# EAGLE schematic motoretc... (EAGLE 8.0.1)
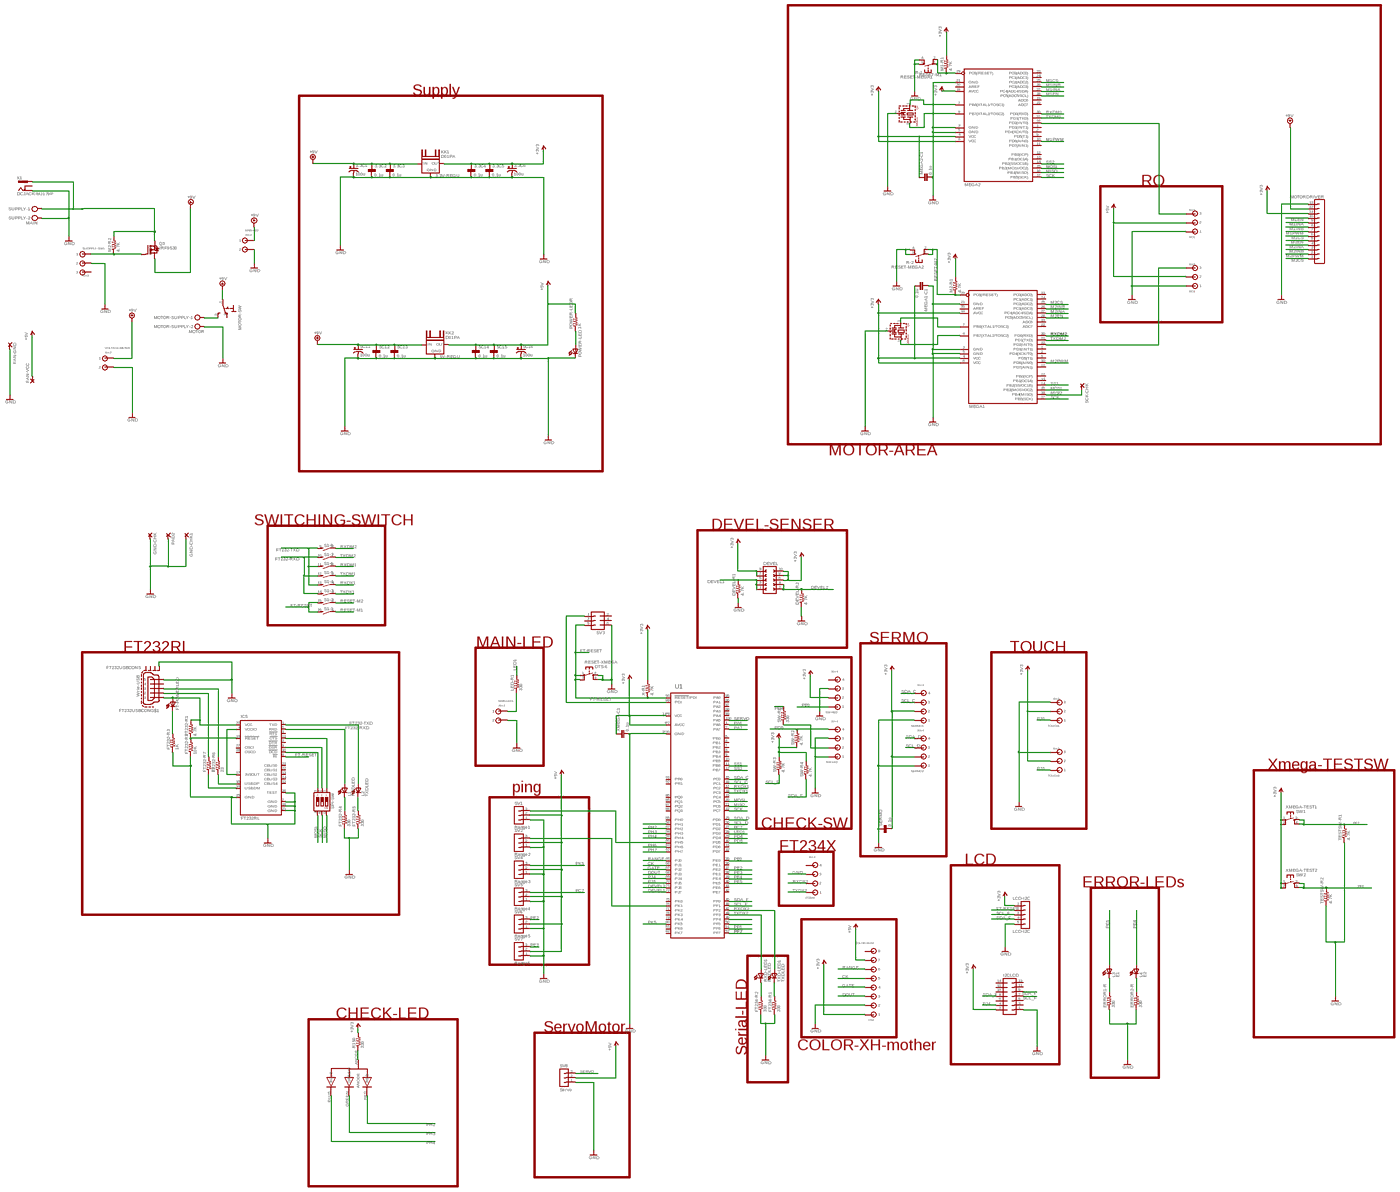
[diagram p0: schematic, sheet 1, overview]
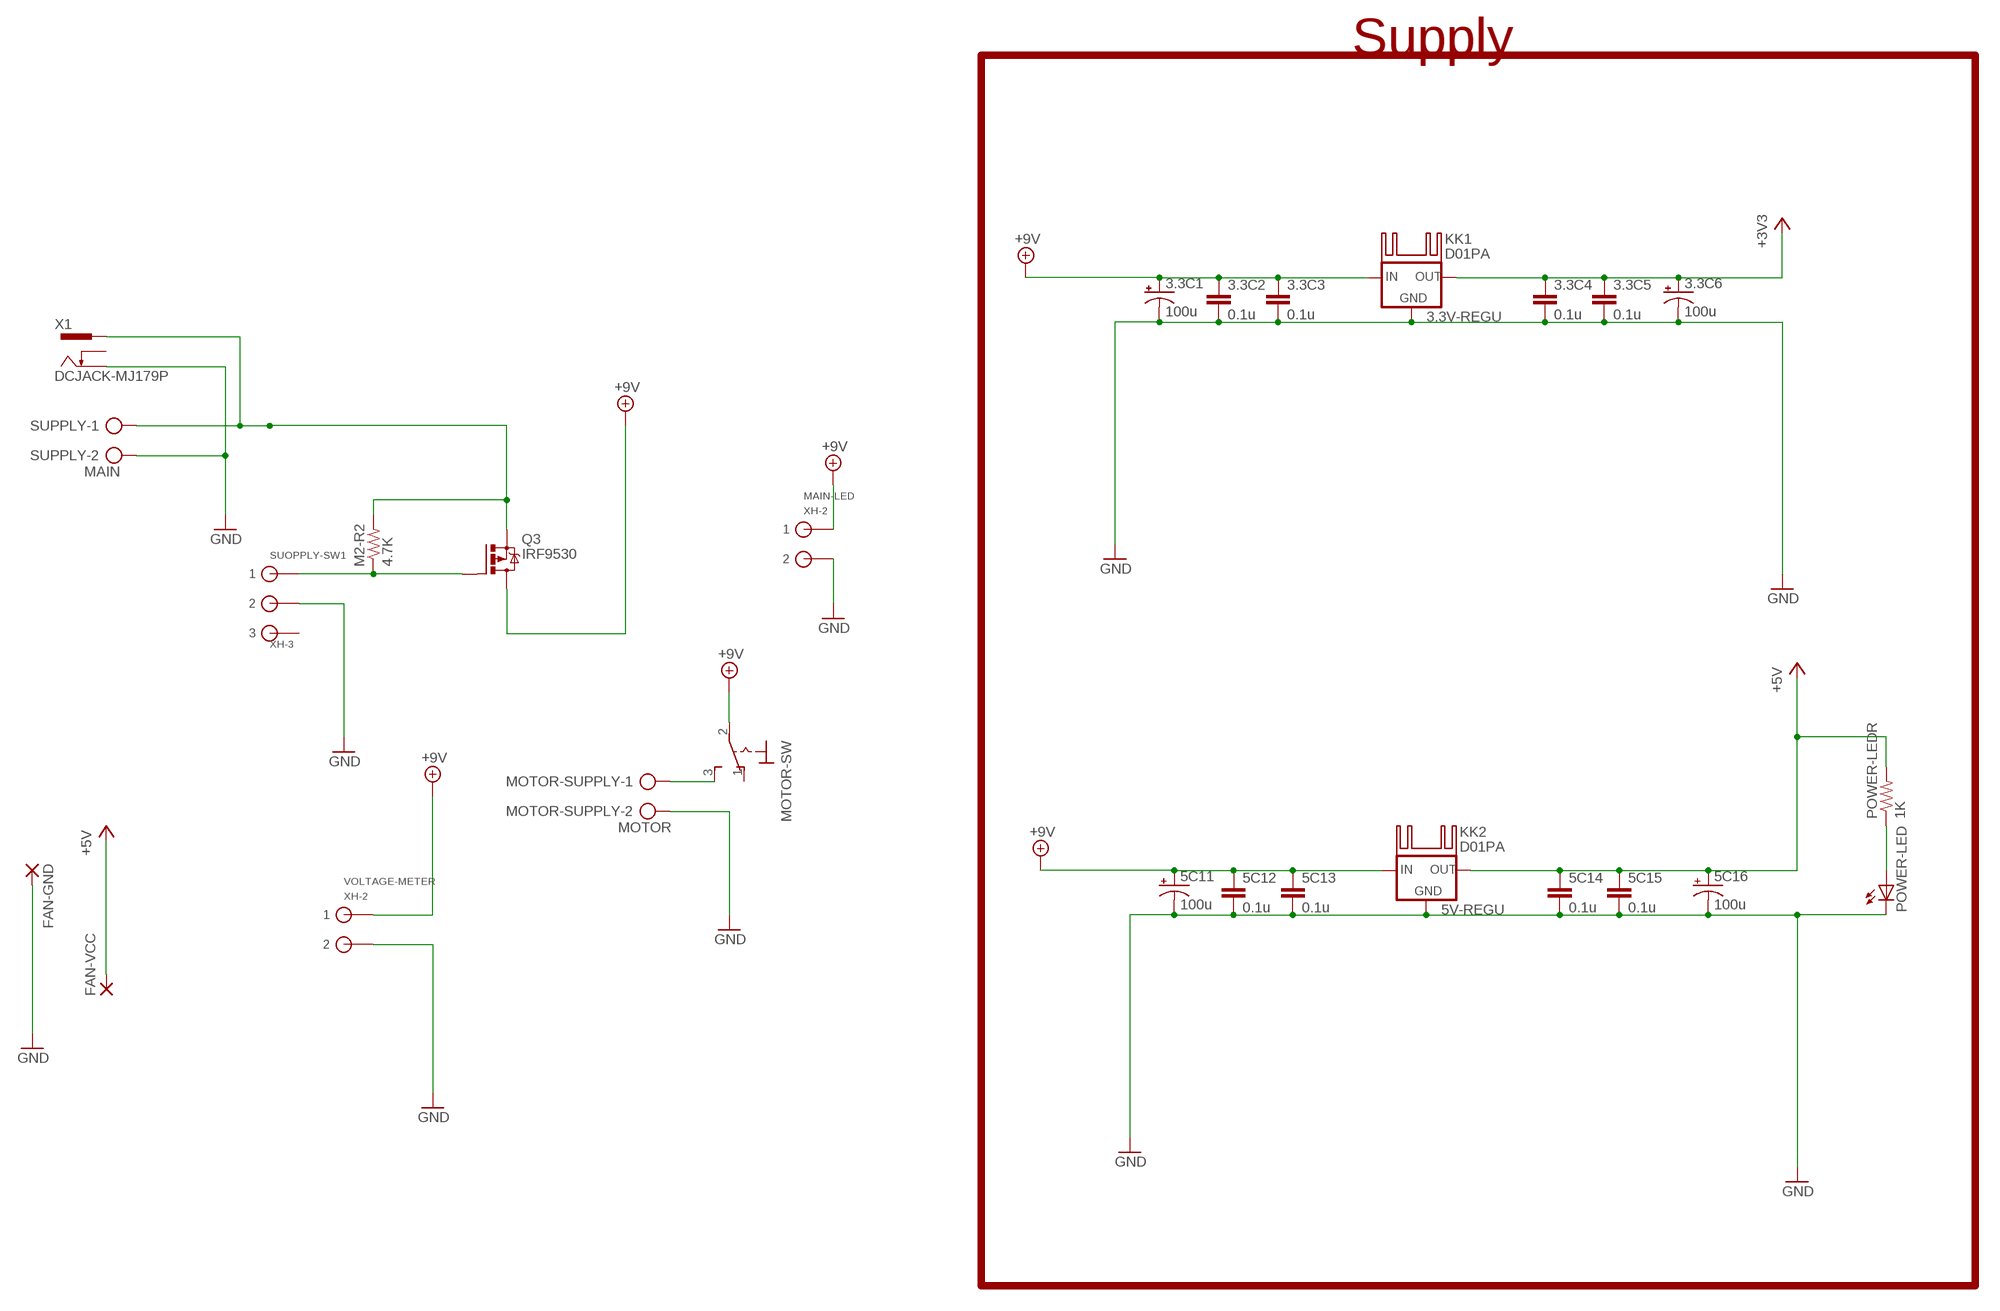
[diagram p1: schematic, sheet 1, part 1 of 4]
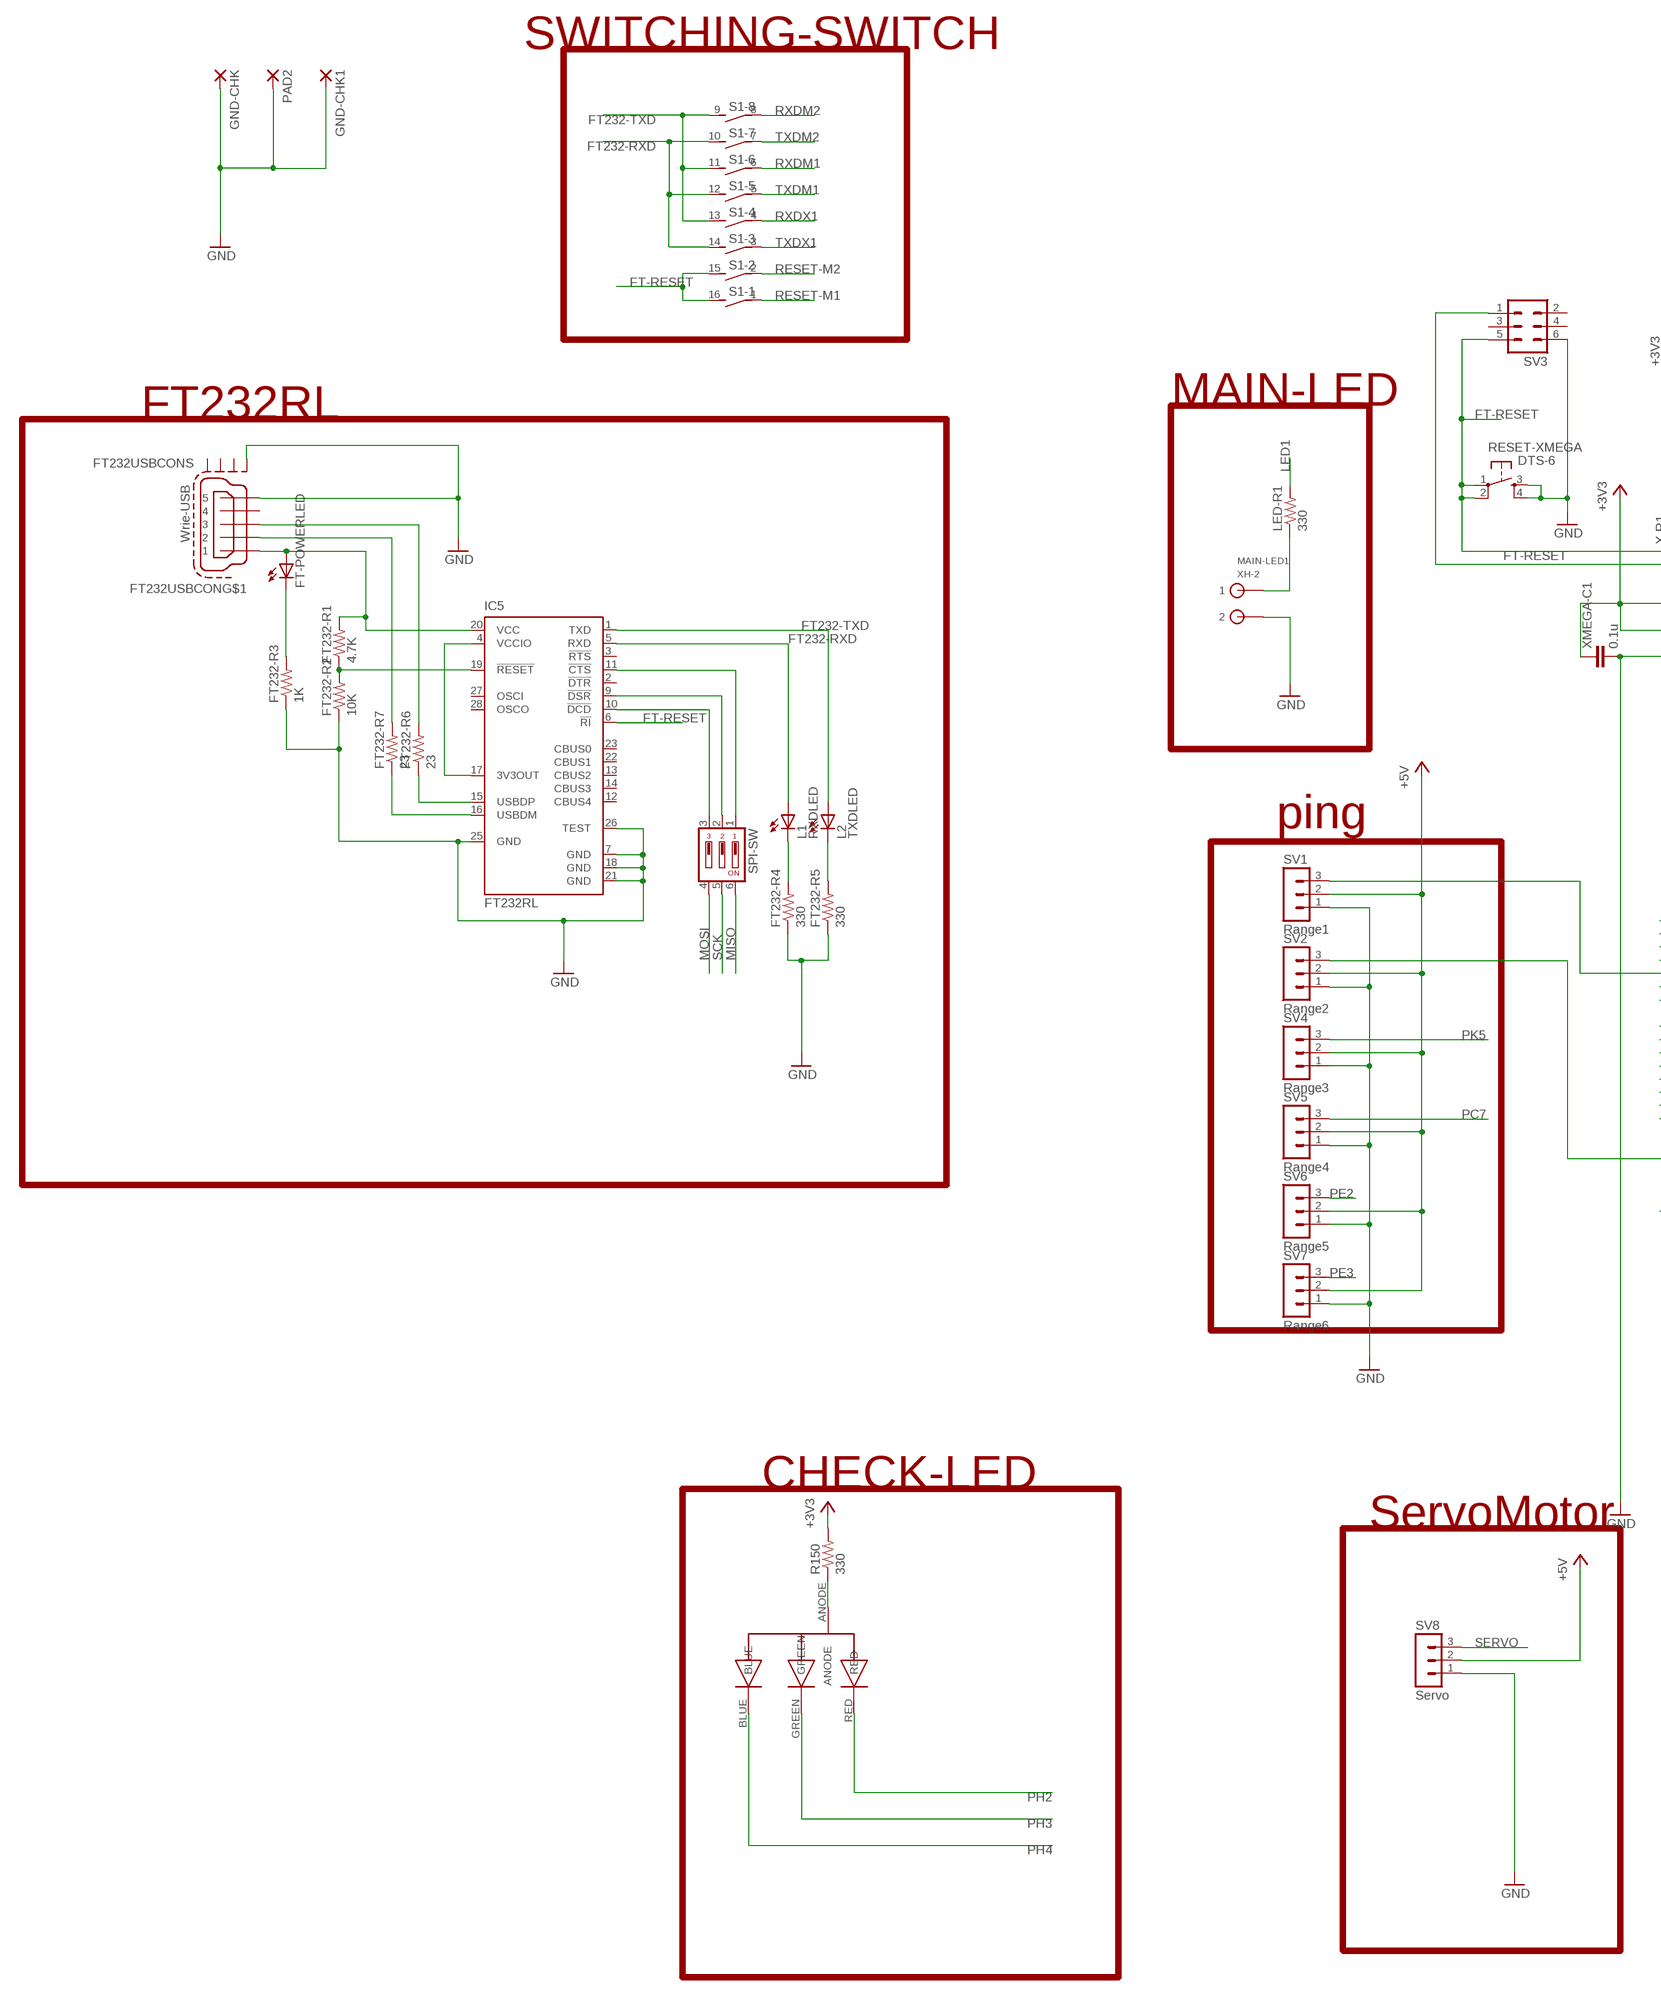
[diagram p2: schematic, sheet 1, part 2 of 4]
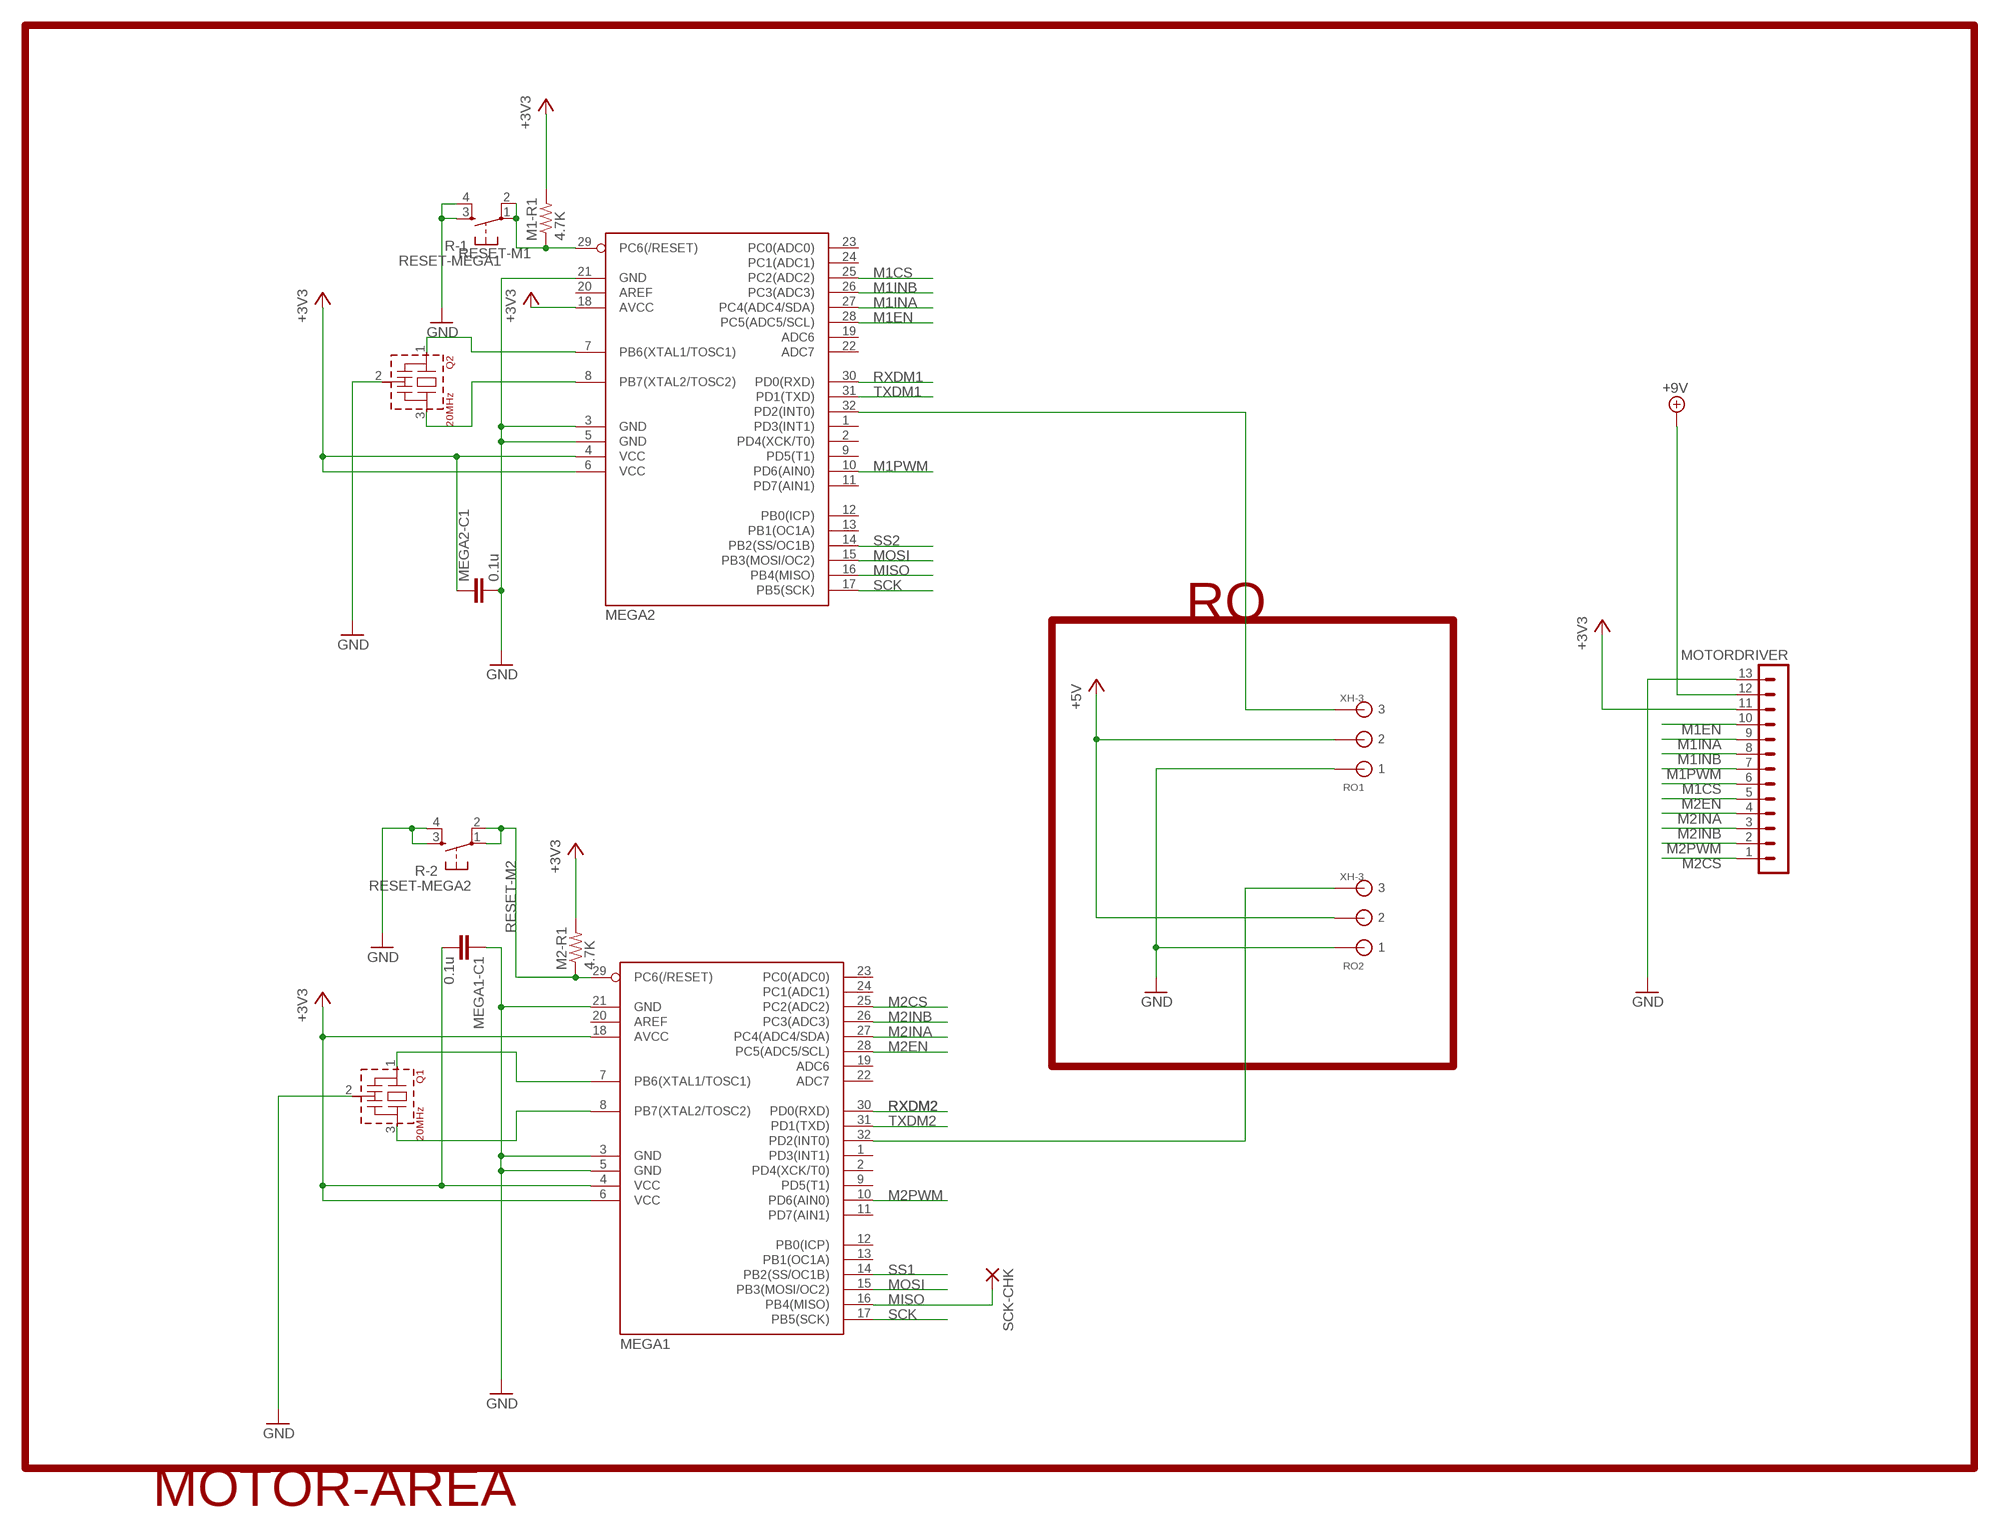
[diagram p3: schematic, sheet 1, part 3 of 4]
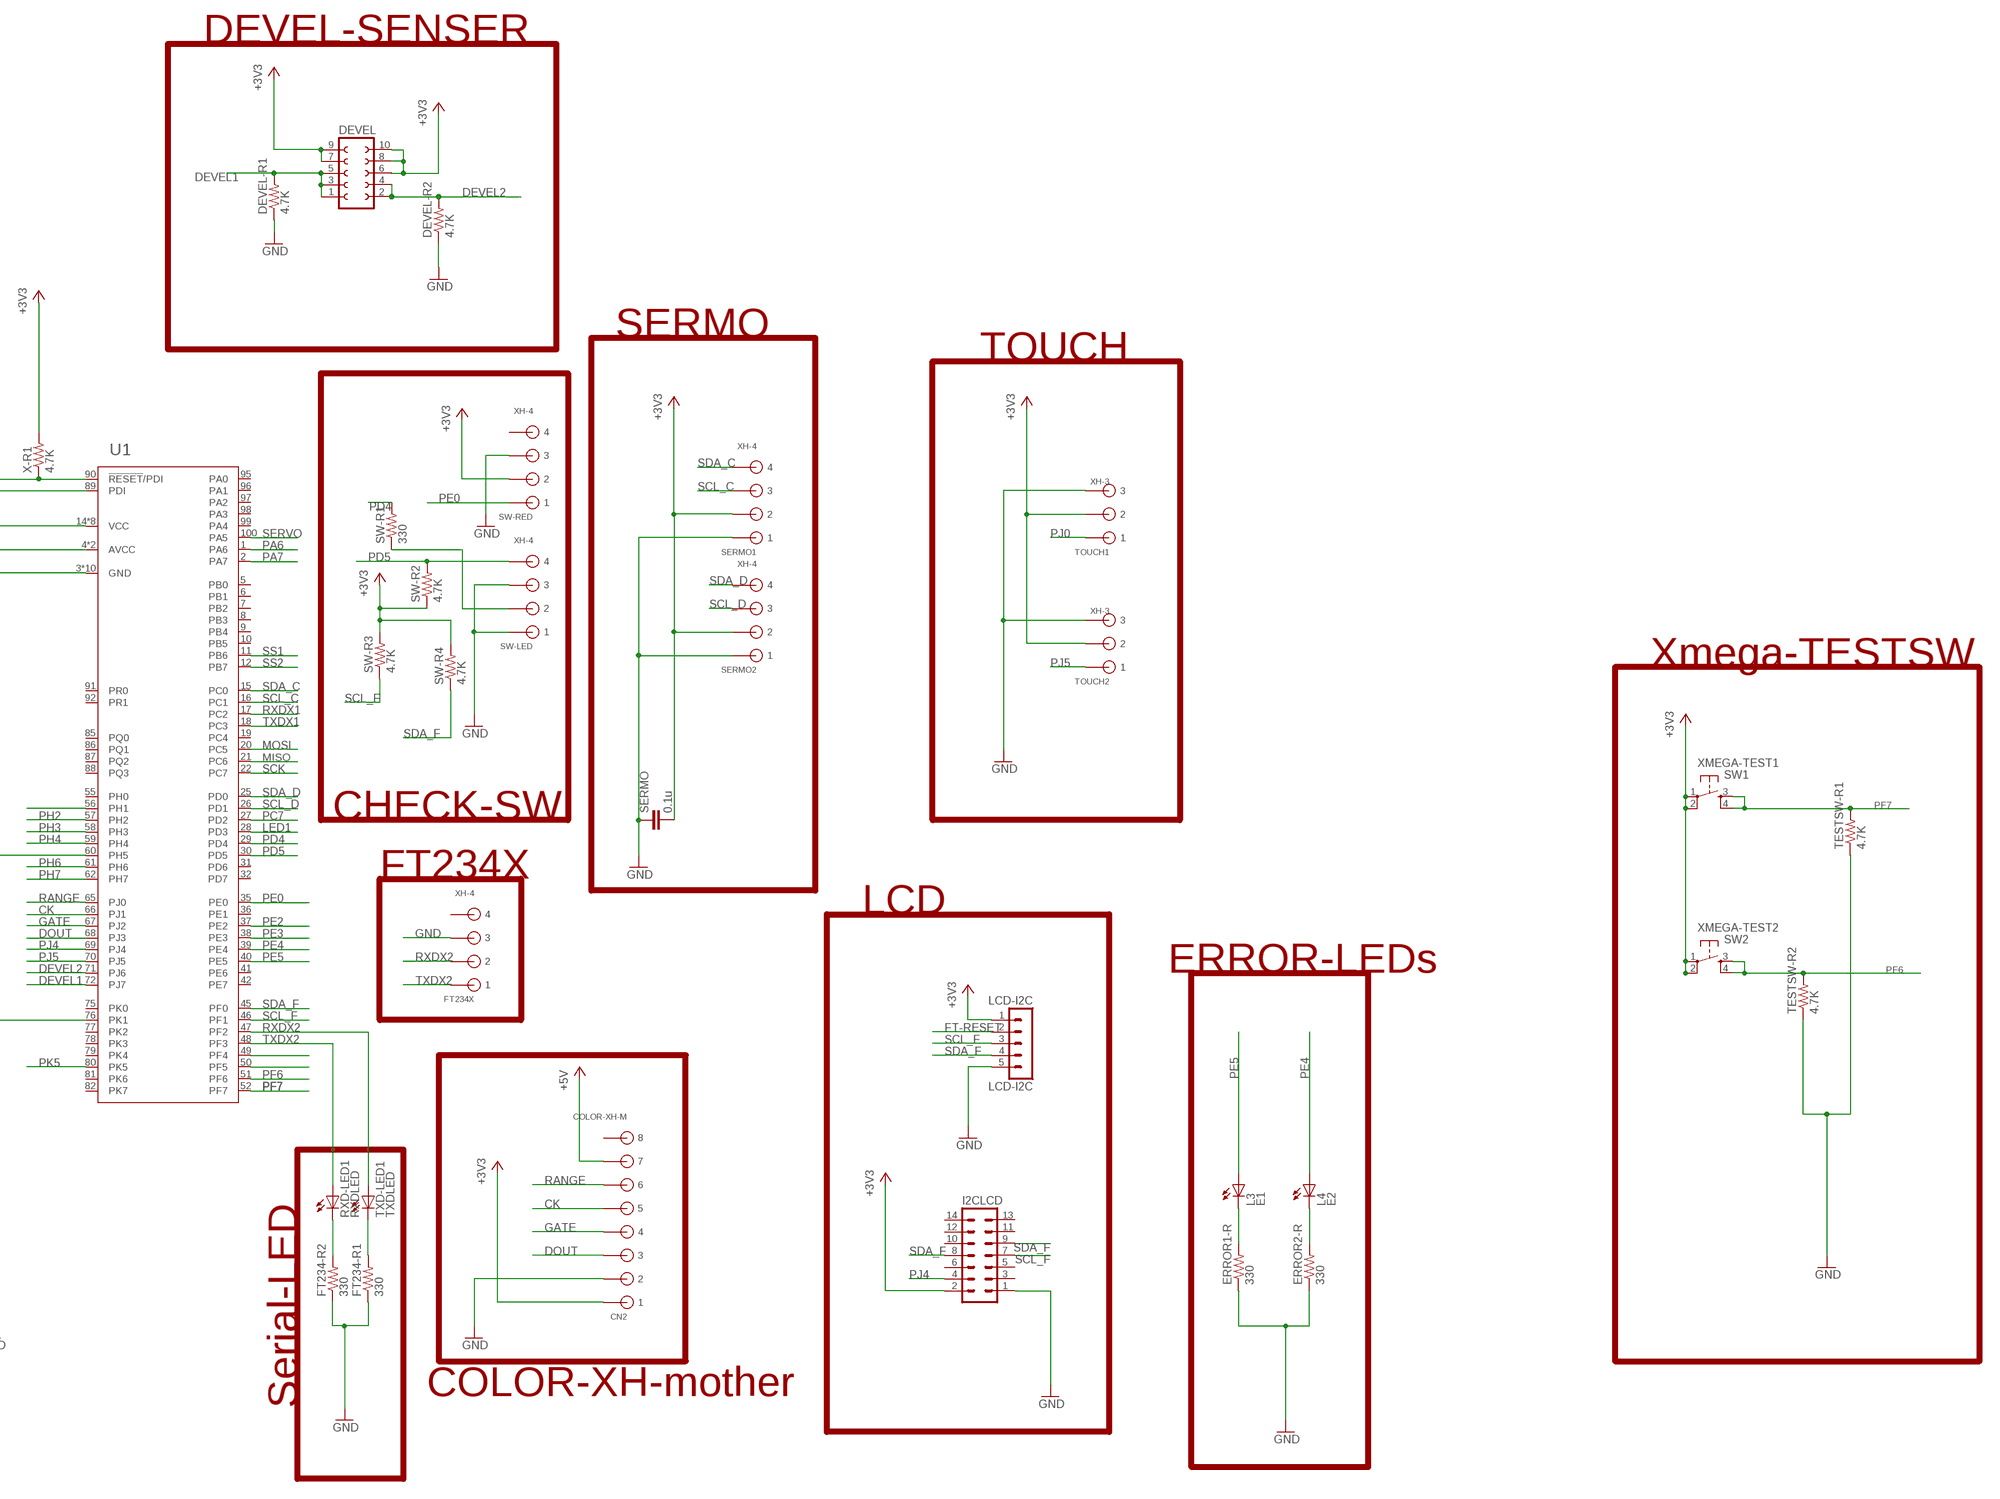
[diagram p4: schematic, sheet 1, part 4 of 4]

## Parts
3.3C1  100u  CPOL-USE2.5-6  [E2,5-6]
3.3C2  0.1u  C-EUC0805  [C0805]
3.3C3  0.1u  C-EUC0805  [C0805]
3.3C4  0.1u  C-EUC0805  [C0805]
3.3C5  0.1u  C-EUC0805  [C0805]
3.3C6  100u  CPOL-USE2.5-6  [E2,5-6]
3.3V-REGU  78XXS  [78XXS]
5C11  100u  CPOL-USE2.5-6  [E2,5-6]
5C12  0.1u  C-EUC0805  [C0805]
5C13  0.1u  C-EUC0805  [C0805]
5C14  0.1u  C-EUC0805  [C0805]
5C15  0.1u  C-EUC0805  [C0805]
5C16  100u  CPOL-USE2.5-6  [E2,5-6]
5V-REGU  78XXS  [78XXS]
CHECKLED  OSTA71A1D-A  [OSTA71A1D-A]
CN2  COLOR-XH-M  XH-8  [CON8]
DEVEL  FE05-2  [FE05-2]
DEVEL-R1  4.7K  R-US_R0805  [R0805]
DEVEL-R2  4.7K  R-US_R0805  [R0805]
ERROR1-R  330  R-US_R0805  [R0805]
ERROR2-R  330  R-US_R0805  [R0805]
FAN-GND  WIREPADSMD1,27-254  [SMD1,27-2,54]
FAN-VCC  WIREPADSMD1,27-254  [SMD1,27-2,54]
FT232-R1  4.7K  R-US_R0805  [R0805]
FT232-R2  10K  R-US_R0805  [R0805]
FT232-R3  1K  R-US_R0805  [R0805]
FT232-R4  330  R-US_R0805  [R0805]
FT232-R5  330  R-US_R0805  [R0805]
FT232-R6  23  R-US_R0805  [R0805]
FT232-R7  23  R-US_R0805  [R0805]
FT232USBCON  Wrie-USB  MINI-USB-SCHIELD-32005-201  [32005-201]
FT234-R1  330  R-US_R0805  [R0805]
FT234-R2  330  R-US_R0805  [R0805]
FT234X  XH-4  [CON4]
FT-POWERLED  LEDCHIPLED_0805  [CHIPLED_0805]
GND-CHK  2,15/1,0  [2,15/1,0]
GND-CHK1  2,15/1,0  [2,15/1,0]
I2CLCD  MA07-2  [MA07-2]
IC5  FT232RL  [SSOP28]
KK1  D01PA  [D01PA]
KK2  D01PA  [D01PA]
L1  RXDLED  LEDCHIPLED_0805  [CHIPLED_0805]
L2  TXDLED  LEDCHIPLED_0805  [CHIPLED_0805]
L3  E1  LED5MM  [LED5MM]
L4  E2  LED5MM  [LED5MM]
LCD-I2C  LCD-I2C  MA05-1  [MA05-1]
LED-R1  330  R-US_R0805  [R0805]
M1-R1  4.7K  R-US_R0805  [R0805]
M2-R1  4.7K  R-US_R0805  [R0805]
M2-R2  4.7K  R-US_R0805  [R0805]
MAIN-LED  XH-2  [CON2]
MAIN-LED1  XH-2  [CON2]
MEGA1  MEGA8-AI  [TQFP32-08]
MEGA1-C1  0.1u  C-EUC0805  [C0805]
MEGA2  MEGA8-AI  [TQFP32-08]
MEGA2-C1  0.1u  C-EUC0805  [C0805]
MOTOR-SUPPLY  MOTOR  AK500/2  [AK500/2]
MOTOR-SW  320-916  [320-916]
MOTORDRIVER  MA13-1  [MA13-1]
PAD2  SMD5  [SMD2,54-5,08]
POWER-LED  LEDCHIPLED_0805  [CHIPLED_0805]
POWER-LEDR  1K  R-US_R0805  [R0805]
Q1  20MHz  CSTLS_X  [CSTLS_X]
Q2  20MHz  CSTLS_X  [CSTLS_X]
Q3  IRF9530  [TO220BV]
R150  330  R-US_R0805  [R0805]
RESET-MEGA1  R-1  DTS-6  [DTS-6]
RESET-MEGA2  R-2  DTS-6  [DTS-6]
RESET-XMEGA  DTS-6  [DTS-6]
RO1  XH-3  [CON3]
RO2  XH-3  [CON3]
RXD-LED1  RXDLED  LEDCHIPLED_0805  [CHIPLED_0805]
S1  DIP08S  [DIP08S]
SCK-CHK  2,15/1,0  [2,15/1,0]
SERMO  0.1u  C-EUC0805  [C0805]
SERMO1  XH-4  [CON4]
SERMO2  XH-4  [CON4]
SPI-SW  DIP03YL  [DIP03YL]
SUOPPLY-SW1  XH-3  [CON3]
SUPPLY  MAIN  AK500/2  [AK500/2]
SV1  Range1  MA03-1  [MA03-1]
SV2  Range2  MA03-1  [MA03-1]
SV3  ML6  [ML6]
SV4  Range3  MA03-1  [MA03-1]
SV5  Range4  MA03-1  [MA03-1]
SV6  Range5  MA03-1  [MA03-1]
SV7  Range6  MA03-1  [MA03-1]
SV8  Servo  MA03-1  [MA03-1]
SW-LED  XH-4  [CON4]
SW-R1  330  R-US_R0805  [R0805]
SW-R2  4.7K  R-US_R0805  [R0805]
SW-R3  4.7K  R-US_R0805  [R0805]
SW-R4  4.7K  R-US_R0805  [R0805]
SW-RED  XH-4  [CON4]
TESTSW-R1  4.7K  R-US_R0805  [R0805]
TESTSW-R2  4.7K  R-US_R0805  [R0805]
TOUCH1  XH-3  [CON3]
TOUCH2  XH-3  [CON3]
TXD-LED1  TXDLED  LEDCHIPLED_0805  [CHIPLED_0805]
U1  ATXMEGA128A1U-AU  [TQFP-100A-100]
VOLTAGE-METER  XH-2  [CON2]
X1  DCJACK-MJ179P  [MJ-179P]
X-R1  4.7K  R-US_R0805  [R0805]
XMEGA-C1  0.1u  C-EUC0805  [C0805]
XMEGA-TEST1  SW1  DTS-6  [DTS-6]
XMEGA-TEST2  SW2  DTS-6  [DTS-6]

## Nets
+3V3: 3.3C4.1 3.3C5.1 3.3C6.+ 3.3V-REGU.OUT CN2.P$1 DEVEL.6 DEVEL.7 DEVEL.8 DEVEL.9 DEVEL.10 I2CLCD.2 LCD-I2C.1 M1-R1.2 M2-R1.2 MEGA1-C1.2 MEGA1.4(VCC) MEGA1.6(VCC) MEGA1.18(AVCC) MEGA2-C1.1 MEGA2.4(VCC) MEGA2.6(VCC) MEGA2.18(AVCC) MOTORDRIVER.11 R150.2 SERMO1.P$2 SERMO2.P$2 SERMO.2 SW-R2.1 SW-R3.2 SW-R4.2 SW-RED.P$2 TOUCH1.P$2 TOUCH2.P$2 U1.4(AVCC) U1.14(VCC) U1.24(VCC) U1.34(VCC) U1.44(VCC) U1.54(VCC) U1.64(VCC) U1.74(VCC) U1.83(VCC) U1.94(AVCC) X-R1.2 XMEGA-C1.1 XMEGA-TEST1.1 XMEGA-TEST1.2 XMEGA-TEST2.1 XMEGA-TEST2.2
+5V: 5C14.1 5C15.1 5C16.+ 5V-REGU.OUT CN2.P$7 FAN-VCC.1(P) POWER-LEDR.2 RO1.P$2 RO2.P$2 SV1.2 SV2.2 SV4.2 SV5.2 SV6.2 SV7.2 SV8.2
+9V: 3.3C1.+ 3.3C2.1 3.3C3.1 3.3V-REGU.IN 5C11.+ 5C12.1 5C13.1 5V-REGU.IN MAIN-LED.P$1 MOTOR-SW.2(P) MOTORDRIVER.12 Q3.D VOLTAGE-METER.P$1
CK: CN2.P$5 U1.66(PJ1)
DEVEL1: DEVEL-R1.2 DEVEL.1 DEVEL.3 DEVEL.5 U1.72(PJ7)
DEVEL2: DEVEL-R2.2 DEVEL.2 DEVEL.4 U1.71(PJ6)
DOUT: CN2.P$3 U1.68(PJ3)
FT232-RXD: IC5.5(RXD) L1.A S1.10 S1.12 S1.14
FT232-TXD: IC5.1(TXD) L2.A S1.9 S1.11 S1.13
FT-POWERLED: FT232-R3.2 FT-POWERLED.C
FT-RESET: IC5.6(!RI) LCD-I2C.2 RESET-XMEGA.1 RESET-XMEGA.2 S1.15 S1.16 SV3.5 U1.90(!RESET!/PDI) X-R1.1
GATE: CN2.P$4 U1.67(PJ2)
GND: 3.3C1.- 3.3C2.2 3.3C3.2 3.3C4.2 3.3C5.2 3.3C6.- 3.3V-REGU.GND 5C11.- 5C12.2 5C13.2 5C14.2 5C15.2 5C16.- 5V-REGU.GND CN2.P$2 DEVEL-R1.1 DEVEL-R2.1 ERROR1-R.1 ERROR2-R.1 FAN-GND.1(P) FT232-R2.1 FT232-R3.1 FT232-R4.1 FT232-R5.1 FT232USBCON.5 FT232USBCON.M1(S:S1) FT234-R1.1 FT234-R2.1 FT234X.P$3 GND-CHK1.1(P) GND-CHK.1(P) I2CLCD.1 IC5.7(GND) IC5.18(GND) IC5.21(GND) IC5.25(GND) IC5.26(TEST) LCD-I2C.5 MAIN-LED1.P$2 MAIN-LED.P$2 MEGA1-C1.1 MEGA1.3(GND) MEGA1.5(GND) MEGA1.21(GND) MEGA2-C1.2 MEGA2.3(GND) MEGA2.5(GND) MEGA2.21(GND) MOTOR-SUPPLY.2 MOTORDRIVER.13 PAD2.1(P) POWER-LED.C Q1.2(VSS) Q2.2(VSS) RESET-MEGA1.3 RESET-MEGA1.4 RESET-MEGA2.3 RESET-MEGA2.4 RESET-XMEGA.3 RESET-XMEGA.4 RO1.P$1 RO2.P$1 SERMO1.P$1 SERMO2.P$1 SERMO.1 SUOPPLY-SW1.P$2 SUPPLY.2 SV1.1 SV2.1 SV3.6 SV4.1 SV5.1 SV6.1 SV7.1 SV8.1 SW-LED.P$1 SW-LED.P$3 SW-RED.P$3 TESTSW-R1.1 TESTSW-R2.1 TOUCH1.P$3 TOUCH2.P$3 U1.3(GND) U1.13(GND) U1.23(GND) U1.33(GND) U1.43(GND) U1.53(GND) U1.63(GND) U1.73(GND) U1.84(GND) U1.93(GND) VOLTAGE-METER.P$2 X1.2 XMEGA-C1.2
LED1: LED-R1.2 U1.28(PD3)
M1CS: MEGA2.25(PC2(ADC2)) MOTORDRIVER.6
M1EN: MEGA2.28(PC5(ADC5/SCL)) MOTORDRIVER.10
M1INA: MEGA2.27(PC4(ADC4/SDA)) MOTORDRIVER.9
M1INB: MEGA2.26(PC3(ADC3)) MOTORDRIVER.8
M1PWM: MEGA2.10(PD6(AIN0)) MOTORDRIVER.7
M2CS: MEGA1.25(PC2(ADC2)) MOTORDRIVER.1
M2EN: MEGA1.28(PC5(ADC5/SCL)) MOTORDRIVER.5
M2INA: MEGA1.27(PC4(ADC4/SDA)) MOTORDRIVER.4
M2INB: MEGA1.26(PC3(ADC3)) MOTORDRIVER.3
M2PWM: MEGA1.10(PD6(AIN0)) MOTORDRIVER.2
MISO: MEGA1.16(PB4(MISO)) MEGA2.16(PB4(MISO)) SCK-CHK.1(P) SPI-SW.6 U1.21(PC6)
MOSI: MEGA1.15(PB3(MOSI/OC2)) MEGA2.15(PB3(MOSI/OC2)) SPI-SW.4 U1.20(PC5)
N$1: SV1.3 U1.60(PH5)
N$2: MEGA2.32(PD2(INT0)) RO1.P$3
N$3: SV2.3 U1.76(PK1)
N$5: POWER-LED.A POWER-LEDR.1
N$6: MEGA1.32(PD2(INT0)) RO2.P$3
N$7: M2-R2.2 Q3.S SUPPLY.1 X1.1
N$8: SV3.1 U1.89(PDI)
N$9: FT232-R6.1 IC5.15(USBDP)
N$10: MEGA1.7(PB6(XTAL1/TOSC1)) Q1.1
N$11: MEGA1.8(PB7(XTAL2/TOSC2)) Q1.3
N$12: FT232-R6.2 FT232USBCON.3
N$13: FT234-R2.2 RXD-LED1.C
N$14: FT232-R7.1 IC5.16(USBDM)
N$15: U1.49(PF4)
N$16: CHECKLED.ANODE R150.1
N$17: FT234-R1.2 TXD-LED1.C
N$18: IC5.11(!CTS) SPI-SW.1
N$19: SW-LED.P$2 SW-R1.1
N$20: MEGA2.7(PB6(XTAL1/TOSC1)) Q2.1
N$21: LED-R1.1 MAIN-LED1.P$1
N$22: IC5.9(!DSR) SPI-SW.2
N$23: FT232-R7.2 FT232USBCON.2
N$24: MEGA2.8(PB7(XTAL2/TOSC2)) Q2.3
N$25: FT232-R1.2 FT232USBCON.1 FT-POWERLED.A IC5.20(VCC)
N$26: FT232-R1.1 FT232-R2.2 IC5.19(!RESET)
N$27: FT232-R4.2 L1.C
N$28: FT232-R5.2 L2.C
N$29: M2-R2.1 Q3.G SUOPPLY-SW1.P$1
N$32: U1.56(PH1)
N$34: IC5.10(!DCD) SPI-SW.3
N$35: IC5.4(VCCIO) IC5.17(3V3OUT)
N$41: MOTOR-SUPPLY.1 MOTOR-SW.3(S)
N$46: ERROR1-R.2 L3.K(C)
N$47: ERROR2-R.2 L4.K(C)
PA6: U1.1(PA6)
PA7: U1.2(PA7)
PC7: SV5.3 U1.27(PD2)
PD4: SW-R1.2 U1.29(PD4)
PD5: SW-LED.P$4 SW-R2.2 U1.30(PD5)
PE0: SW-RED.P$1 U1.35(PE0)
PE2: SV6.3 U1.37(PE2)
PE3: SV7.3 U1.38(PE3)
PE4: L4.A U1.39(PE4)
PE5: L3.A U1.40(PE5)
PF5: U1.50(PF5)
PF6: TESTSW-R2.2 U1.51(PF6) XMEGA-TEST2.3 XMEGA-TEST2.4
PF7: TESTSW-R1.2 U1.52(PF7) XMEGA-TEST1.3 XMEGA-TEST1.4
PH2: CHECKLED.RED U1.57(PH2)
PH3: CHECKLED.GREEN U1.58(PH3)
PH4: CHECKLED.BLUE U1.59(PH4)
PH6: U1.61(PH6)
PH7: U1.62(PH7)
PJ0: TOUCH1.P$1
PJ4: I2CLCD.4 U1.69(PJ4)
PJ5: TOUCH2.P$1 U1.70(PJ5)
PK5: SV4.3 U1.80(PK5)
RANGE: CN2.P$6 U1.65(PJ0)
RESET-M1: M1-R1.1 MEGA2.29(PC6(/RESET)) RESET-MEGA1.1 RESET-MEGA1.2 S1.1
RESET-M2: M2-R1.1 MEGA1.29(PC6(/RESET)) RESET-MEGA2.1 RESET-MEGA2.2 S1.2
RXDM1: MEGA2.30(PD0(RXD)) S1.6
RXDM2: MEGA1.30(PD0(RXD)) S1.8
RXDX1: S1.4 U1.17(PC2)
RXDX2: FT234X.P$2 TXD-LED1.A U1.47(PF2)
SCK: MEGA1.17(PB5(SCK)) MEGA2.17(PB5(SCK)) SPI-SW.5 U1.22(PC7)
SCL_C: SERMO1.P$3 U1.16(PC1)
SCL_D: SERMO2.P$3 U1.26(PD1)
SCL_F: I2CLCD.7 LCD-I2C.3 SW-R3.1 U1.46(PF1)
SDA_C: SERMO1.P$4 U1.15(PC0)
SDA_D: SERMO2.P$4 U1.25(PD0)
SDA_F: I2CLCD.8 I2CLCD.9 LCD-I2C.4 SW-R4.1 U1.45(PF0)
SERVO: SV8.3 U1.100(PA5)
SS1: MEGA1.14(PB2(SS/OC1B)) U1.11(PB6)
SS2: MEGA2.14(PB2(SS/OC1B)) U1.12(PB7)
TXDM1: MEGA2.31(PD1(TXD)) S1.5
TXDM2: MEGA1.31(PD1(TXD)) S1.7
TXDX1: S1.3 U1.18(PC3)
TXDX2: FT234X.P$1 RXD-LED1.A U1.48(PF3)
Unconnected: CN2.P$8 FT232USBCON.4 FT232USBCON.M2(S:S2) FT232USBCON.M3(S:S3) FT232USBCON.M4(S:S4) FT234X.P$4 I2CLCD.3 I2CLCD.5 I2CLCD.6 I2CLCD.10 I2CLCD.11 I2CLCD.12 I2CLCD.13 I2CLCD.14 IC5.2(!DTR) IC5.3(!RTS) IC5.12(CBUS4) IC5.13(CBUS2) IC5.14(CBUS3) IC5.22(CBUS1) IC5.23(CBUS0) IC5.27(OSCI) IC5.28(OSCO) MEGA1.1(PD3(INT1)) MEGA1.2(PD4(XCK/T0)) MEGA1.9(PD5(T1)) MEGA1.11(PD7(AIN1)) MEGA1.12(PB0(ICP)) MEGA1.13(PB1(OC1A)) MEGA1.19(ADC6) MEGA1.20(AREF) MEGA1.22(ADC7) MEGA1.23(PC0(ADC0)) MEGA1.24(PC1(ADC1)) MEGA2.1(PD3(INT1)) MEGA2.2(PD4(XCK/T0)) MEGA2.9(PD5(T1)) MEGA2.11(PD7(AIN1)) MEGA2.12(PB0(ICP)) MEGA2.13(PB1(OC1A)) MEGA2.19(ADC6) MEGA2.20(AREF) MEGA2.22(ADC7) MEGA2.23(PC0(ADC0)) MEGA2.24(PC1(ADC1)) MOTOR-SW.1(O) SUOPPLY-SW1.P$3 SV3.2 SV3.3 SV3.4 SW-RED.P$4 U1.5(PB0) U1.6(PB1) U1.7(PB2) U1.8(PB3) U1.9(PB4) U1.10(PB5) U1.19(PC4) U1.31(PD6) U1.32(PD7) U1.36(PE1) U1.41(PE6) U1.42(PE7) U1.55(PH0) U1.75(PK0) U1.77(PK2) U1.78(PK3) U1.79(PK4) U1.81(PK6) U1.82(PK7) U1.85(PQ0) U1.86(PQ1) U1.87(PQ2) U1.88(PQ3) U1.91(PR0) U1.92(PR1) U1.95(PA0) U1.96(PA1) U1.97(PA2) U1.98(PA3) U1.99(PA4) X1.3

## Notes on the sheet
- Supply
- RO
- MOTOR-AREA
- SWITCHING-SWITCH | DEVEL-SENSER
- MAIN-LED | SERMO
- FT232RL | TOUCH
- Xmega-TESTSW
- ping
- CHECK-SW
- FT234X
- LCD
- ERROR-LEDs
- CHECK-LED
- ServoMotor
- Serial-LED | COLOR-XH-mother

## Library data of the parts
3.3C1 3.3C6 5C11 5C16 = rcl:CPOL-US: POLARIZED CAPACITOR, American symbol
3.3C2-3.3C5 5C12-5C15 MEGA1-C1 MEGA2-C1 SERMO XMEGA-C1 = rcl:C-EU: CAPACITOR, European symbol
3.3V-REGU 5V-REGU = v-reg:78XXS: VOLTAGE REGULATOR
CHECKLED = FullColorLed-forprint:OSTA71A1D-A
CN2 = forprint:XH-8: LOW INSERTION CONNECTOR 8
DEVEL = con-lsta:FE05-2: FEMALE HEADER; OC_FARNELL: unknown; OC_NEWARK: unknown
DEVEL-R1 DEVEL-R2 ERROR1-R ERROR2-R FT232-R1-FT232-R7 FT234-R1 FT234-R2 LED-R1 M1-R1 M2-R1 M2-R2 POWER-LEDR R150 SW-R1-SW-R4 TESTSW-R1 TESTSW-R2 X-R1 = 0@Mylibrary-main1:R-US_: RESISTOR, American symbol
FAN-GND FAN-VCC = 0@Mylibrary-main1:WIREPAD: Wire PAD connect wire on PCB
FT232USBCON = con-cypressindustries:MINI-USB-SCHIELD-: MINI USB-B Conector Source: www.cypressindustries.com; OC_FARNELL: unknown; OC_NEWARK: unknown
FT234X SERMO1 SERMO2 SW-LED SW-RED = forprint:XH-4: Low insertion connector 4pin
FT-POWERLED L1 L2 POWER-LED RXD-LED1 TXD-LED1 = led:LED: LED OSRAM: - CHIPLED LG R971, LG N971, LY N971, LG Q971, LY Q971, LO R971, LY R971 LH N974, LH R974 LS Q976, LO Q976, LY Q976 LO Q996 - Hyper CHIPLED LW Q18S LB Q993, LB Q99A, LB R99A - SideLED LS A670, LO A670, LY A670, LG A670, LP A670 LB A673, LV A673, LT A673, LW A673 LH A674 LY A675 LS A676, LA A676, LO A676, LY A676, LW A676 LS A679, LY A679, LG A679 - Hyper Micro SIDELED® LS Y876, LA Y876, LO Y876, LY Y876 LT Y87S - SmartLED LW L88C, LW L88S LB L89C, LB L89S, LG L890 LS L89K, LO L89K, LY L89K LS L896, LA L896, LO L896, LY L896 - TOPLED LS T670, LO T670, LY T670, LG T670, LP T670 LSG T670, LSP T670, LSY T670, LOP T670, LYG T670 LG T671, LOG T671, LSG T671 LB T673, LV T673, LT T673, LW T673 LH T674 LS T676, LA T676, LO T676, LY T676, LB T676, LH T676, LSB T676, LW T676 LB T67C, LV T67C, LT T67C, LS T67K, LO T67K, LY T67K, LW E67C LS E67B, LA E67B, LO E67B, LY E67B, LB E67C, LV E67C, LT E67C LW T67C LS T679, LY T679, LG T679 LS T770, LO T770, LY T770, LG T770, LP T770 LB T773, LV T773, LT T773, LW T773 LH T774 LS E675, LA E675, LY E675, LS T675 LS T776, LA T776, LO T776, LY T776, LB T776 LHGB T686 LT T68C, LB T68C - Hyper Mini TOPLED® LB M676 - Mini TOPLED Santana® LG M470 LS M47K, LO M47K, LY M47K Source: http://www.osram.convergy.de LUXEON: - LUMILED® LXK2-PW12-R00, LXK2-PW12-S00, LXK2-PW14-U00, LXK2-PW14-V00 LXK2-PM12-R00, LXK2-PM12-S00, LXK2-PM14-U00 LXK2-PE12-Q00, LXK2-PE12-R00, LXK2-PE12-S00, LXK2-PE14-T00, LXK2-PE14-U00 LXK2-PB12-K00, LXK2-PB12-L00, LXK2-PB12-M00, LXK2-PB14-N00, LXK2-PB14-P00, LXK2-PB14-Q00 LXK2-PR12-L00, LXK2-PR12-M00, LXK2-PR14-Q00, LXK2-PR14-R00 LXK2-PD12-Q00, LXK2-PD12-R00, LXK2-PD12-S00 LXK2-PH12-R00, LXK2-PH12-S00 LXK2-PL12-P00, LXK2-PL12-Q00, LXK2-PL12-R00 Source: www.luxeon.com KINGBRIGHT: KA-3528ASYC Source: www.kingbright.com
GND-CHK GND-CHK1 SCK-CHK = wirepad:2,15/1,0: THROUGH-HOLE PAD
I2CLCD = 0con-lstb:MA07-2: PIN HEADER; OC_FARNELL: unknown; OC_NEWARK: unknown
IC5 = ftdichip:FT232R: Source: http://www.ftdichip.com/Documents/DataSheets/DS_FT232R_v104.pdf; MPN: FT232RL; OC_FARNELL: 1146032; OC_NEWARK: 91K9918
KK1 KK2 = heatsink:D01PA: HEATSINK distributor Schukat
L3 L4 = 0led:LED: LED OSRAM: - CHIPLED LG R971, LG N971, LY N971, LG Q971, LY Q971, LO R971, LY R971 LH N974, LH R974 LS Q976, LO Q976, LY Q976 LO Q996 - Hyper CHIPLED LW Q18S LB Q993, LB Q99A, LB R99A - SideLED LS A670, LO A670, LY A670, LG A670, LP A670 LB A673, LV A673, LT A673, LW A673 LH A674 LY A675 LS A676, LA A676, LO A676, LY A676, LW A676 LS A679, LY A679, LG A679 - Hyper Micro SIDELED® LS Y876, LA Y876, LO Y876, LY Y876 LT Y87S - SmartLED LW L88C, LW L88S LB L89C, LB L89S, LG L890 LS L89K, LO L89K, LY L89K LS L896, LA L896, LO L896, LY L896 - TOPLED LS T670, LO T670, LY T670, LG T670, LP T670 LSG T670, LSP T670, LSY T670, LOP T670, LYG T670 LG T671, LOG T671, LSG T671 LB T673, LV T673, LT T673, LW T673 LH T674 LS T676, LA T676, LO T676, LY T676, LB T676, LH T676, LSB T676, LW T676 LB T67C, LV T67C, LT T67C, LS T67K, LO T67K, LY T67K, LW E67C LS E67B, LA E67B, LO E67B, LY E67B, LB E67C, LV E67C, LT E67C LW T67C LS T679, LY T679, LG T679 LS T770, LO T770, LY T770, LG T770, LP T770 LB T773, LV T773, LT T773, LW T773 LH T774 LS E675, LA E675, LY E675, LS T675 LS T776, LA T776, LO T776, LY T776, LB T776 LHGB T686 LT T68C, LB T68C - Hyper Mini TOPLED® LB M676 - Mini TOPLED Santana® LG M470 LS M47K, LO M47K, LY M47K Source: http://www.osram.convergy.de LUXEON: - LUMILED® LXK2-PW12-R00, LXK2-PW12-S00, LXK2-PW14-U00, LXK2-PW14-V00 LXK2-PM12-R00, LXK2-PM12-S00, LXK2-PM14-U00 LXK2-PE12-Q00, LXK2-PE12-R00, LXK2-PE12-S00, LXK2-PE14-T00, LXK2-PE14-U00 LXK2-PB12-K00, LXK2-PB12-L00, LXK2-PB12-M00, LXK2-PB14-N00, LXK2-PB14-P00, LXK2-PB14-Q00 LXK2-PR12-L00, LXK2-PR12-M00, LXK2-PR14-Q00, LXK2-PR14-R00 LXK2-PD12-Q00, LXK2-PD12-R00, LXK2-PD12-S00 LXK2-PH12-R00, LXK2-PH12-S00 LXK2-PL12-P00, LXK2-PL12-Q00, LXK2-PL12-R00 Source: www.luxeon.com KINGBRIGHT: KA-3528ASYC Source: www.kingbright.com
LCD-I2C = con-lstb-forprint:MA05-1: PIN HEADER; OC_FARNELL: unknown; OC_NEWARK: unknown
MAIN-LED MAIN-LED1 VOLTAGE-METER = forprint:XH-2: low insertion CON
MEGA1 MEGA2 = atmel:MEGA8: MICROCONTROLLER 8 Kbytes FLASH, 1 kbytes SRAM, 512 bytes EEPROM, USART, 6-channel 10 bit ADC, 2-channel 8 bit ADC Pin compatible with Atmega48, ATMega88, ATMega168 Source: avr.lbr; MPN: ATMEGA8-16AU; OC_FARNELL: 9171371; OC_NEWARK: 73M8863
MOTOR-SUPPLY SUPPLY = con-ptr500:AK500/2: CONNECTOR; OC_FARNELL: unknown; OC_NEWARK: unknown
MOTOR-SW = 0switch:320-916: TOGGLE SWITCH distributor RS Components
MOTORDRIVER = con-lstb-forprint:MA13-1: PIN HEADER; OC_FARNELL: unknown; OC_NEWARK: unknown
PAD2 = wirepad:SMD5: SMD PAD
Q1 Q2 = 0Murata-ceralocks-forprint:CSTLS_X: Ceramic resonator 16.00 to 70.00 MHz
Q3 = transistor-power:IRF9530: P-CHANNEL HEXFET POWER-MOS-FET Source: http://www.irf.com/product-info/datasheets/data/irf9530.pdf
RESET-MEGA1 RESET-MEGA2 RESET-XMEGA XMEGA-TEST1 XMEGA-TEST2 = forprint:DTS-6
RO1 RO2 SUOPPLY-SW1 TOUCH1 TOUCH2 = forprint:XH-3: low insertion CON
S1 = switch-dil-forprint:DIP08S: DIL/CODE SWITCH; OC_FARNELL: unknown; OC_NEWARK: unknown
SPI-SW = switch-dil:DIP03YL: DIL/CODE SWITCH
SV1 SV2 SV4-SV8 = con-lstb-forprint:MA03-1: PIN HEADER; OC_FARNELL: unknown; OC_NEWARK: unknown
SV3 = con-harting-ml:ML6: HARTING; OC_FARNELL: unknown; OC_NEWARK: unknown
U1 = atmel-xmega:ATXMEGA128A1U: 8/16-bit XMEGA A1U Microcontroller Features High-performance, low-power Atmel® AVR® XMEGA® 8/16-bit Microcontroller Nonvolatileprogram and data memories – 64K - 128KBytes of in-system self-programmable flash – 4K - 8KBytes boot section – 2KBytes EEPROM – 4K - 8KBytes internal SRAM External bus interface for up to 16Mbytes SRAM External bus interface for up to 128Mbit SDRAM Peripheral features – Four-channel DMA controller – Eight-channel event system – Eight 16-bit timer/counters Four timer/counters with 4 output compare or input capture channels Four timer/counters with 2 output compare or input capture channels High resolution extension on all timer/counters Advanced waveform extension (AWeX) on two timer/counters – One USB device interface USB 2.0 full speed (12Mbps) and low speed (1.5Mbps) device compliant 32 Endpoints with full configuration flexibility – Eight USARTs with IrDA support for one USART – Four two-wire interfaces with dual address match (I2C and SMBus compatible) – Four serial peripheral interfaces (SPIs) – AES and DES crypto engine – CRC-16 (CRC-CCITT) and CRC-32 (IEEE® 802.3) generator – 16-bit real time counter (RTC) with separate oscillator – Two sixteen channel, 12-bit, 2msps Analog to Digital Converters – Two Two-channel, 12-bit, 1msps Digital to Analog Converters – Four Analog Comparators (ACs) with window compare function, and current sources – External interrupts on all general purpose I/O pins – Programmable watchdog timer with separate on-chip ultra low power oscillator – QTouch® library support Capacitive touch buttons, sliders and wheels Special microcontroller features – Power-on reset and programmable brown-out detection – Internal and external clock options with PLL and prescaler – Programmable multilevel interrupt controller – Five sleep modes – Programming and debug interfaces JTAG (IEEE 1149.1 compliant) interface, including boundary scan PDI (Program and Debug Interface) I/O and packages – 78 Programmable I/O pins – 100 lead TQFP – 100 ball BGA – 100 ball VFBGA Operating voltage – 1.6 – 3.6V Operating frequency – 0 – 12MHz from 1.6V – 0 – 32MHz from 2.7V
X1 = kamiki-dcjack:DCJACK: DC JACK 2.1mmφ - 5.5mmφ DCジャック、基板用。